# EAGLE schematic swbox_main (EAGLE 6.3)
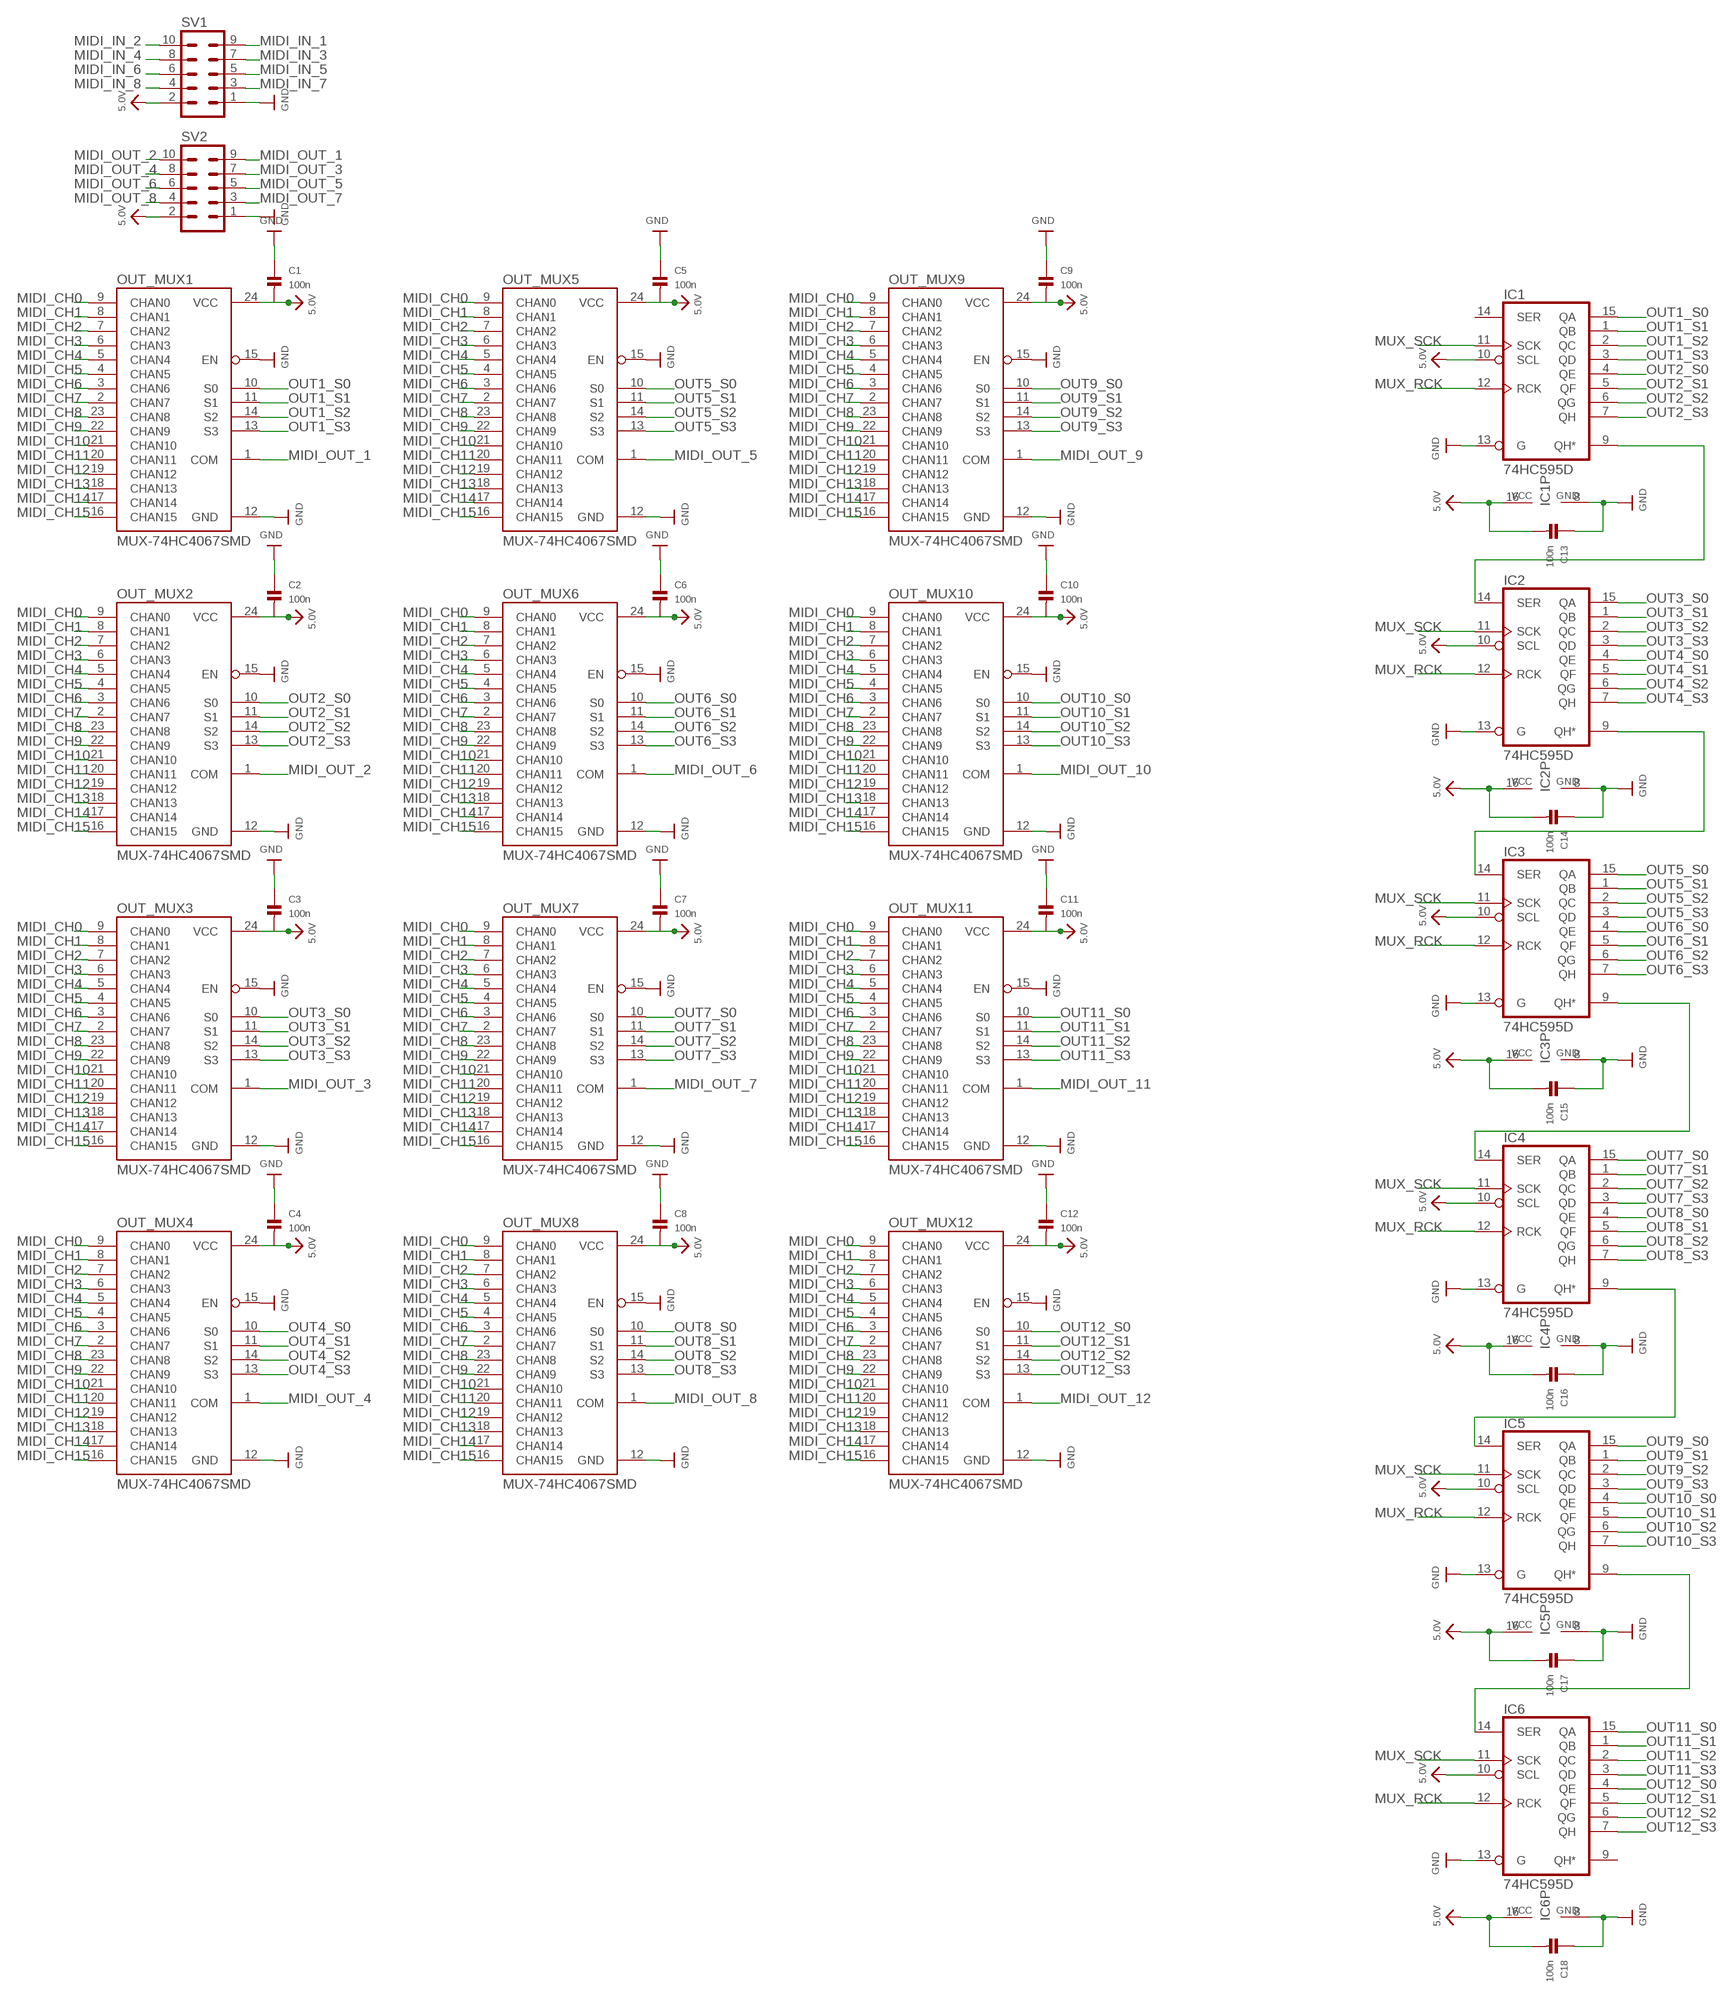
[diagram p0: schematic, sheet 1]

## Parts
C1  100n  CAP_CERAMIC0603  [0603]
C2  100n  CAP_CERAMIC0603  [0603]
C3  100n  CAP_CERAMIC0603  [0603]
C4  100n  CAP_CERAMIC0603  [0603]
C5  100n  CAP_CERAMIC0603  [0603]
C6  100n  CAP_CERAMIC0603  [0603]
C7  100n  CAP_CERAMIC0603  [0603]
C8  100n  CAP_CERAMIC0603  [0603]
C9  100n  CAP_CERAMIC0603  [0603]
C10  100n  CAP_CERAMIC0603  [0603]
C11  100n  CAP_CERAMIC0603  [0603]
C12  100n  CAP_CERAMIC0603  [0603]
C13  100n  CAP_CERAMIC0603  [0603]
C14  100n  CAP_CERAMIC0603  [0603]
C15  100n  CAP_CERAMIC0603  [0603]
C16  100n  CAP_CERAMIC0603  [0603]
C17  100n  CAP_CERAMIC0603  [0603]
C18  100n  CAP_CERAMIC0603  [0603]
IC1  74HC595D  [SO16]
IC2  74HC595D  [SO16]
IC3  74HC595D  [SO16]
IC4  74HC595D  [SO16]
IC5  74HC595D  [SO16]
IC6  74HC595D  [SO16]
OUT_MUX1  MUX-74HC4067SMD  [SSOP24]
OUT_MUX2  MUX-74HC4067SMD  [SSOP24]
OUT_MUX3  MUX-74HC4067SMD  [SSOP24]
OUT_MUX4  MUX-74HC4067SMD  [SSOP24]
OUT_MUX5  MUX-74HC4067SMD  [SSOP24]
OUT_MUX6  MUX-74HC4067SMD  [SSOP24]
OUT_MUX7  MUX-74HC4067SMD  [SSOP24]
OUT_MUX8  MUX-74HC4067SMD  [SSOP24]
OUT_MUX9  MUX-74HC4067SMD  [SSOP24]
OUT_MUX10  MUX-74HC4067SMD  [SSOP24]
OUT_MUX11  MUX-74HC4067SMD  [SSOP24]
OUT_MUX12  MUX-74HC4067SMD  [SSOP24]
SV1  ML10  [ML10]
SV2  ML10  [ML10]

## Nets
5.0V: C1.2 C2.2 C3.2 C4.2 C5.2 C6.2 C7.2 C8.2 C9.2 C10.2 C11.2 C12.2 C13.2 C14.2 C15.2 C16.2 C17.2 C18.2 IC1.10(SCL) IC1.16(VCC) IC2.10(SCL) IC2.16(VCC) IC3.10(SCL) IC3.16(VCC) IC4.10(SCL) IC4.16(VCC) IC5.10(SCL) IC5.16(VCC) IC6.10(SCL) IC6.16(VCC) OUT_MUX1.24(VCC) OUT_MUX2.24(VCC) OUT_MUX3.24(VCC) OUT_MUX4.24(VCC) OUT_MUX5.24(VCC) OUT_MUX6.24(VCC) OUT_MUX7.24(VCC) OUT_MUX8.24(VCC) OUT_MUX9.24(VCC) OUT_MUX10.24(VCC) OUT_MUX11.24(VCC) OUT_MUX12.24(VCC) SV1.2 SV2.2
GND: C1.1 C2.1 C3.1 C4.1 C5.1 C6.1 C7.1 C8.1 C9.1 C10.1 C11.1 C12.1 C13.1 C14.1 C15.1 C16.1 C17.1 C18.1 IC1.8(GND) IC1.13(G) IC2.8(GND) IC2.13(G) IC3.8(GND) IC3.13(G) IC4.8(GND) IC4.13(G) IC5.8(GND) IC5.13(G) IC6.8(GND) IC6.13(G) OUT_MUX1.12(GND) OUT_MUX1.15(EN) OUT_MUX2.12(GND) OUT_MUX2.15(EN) OUT_MUX3.12(GND) OUT_MUX3.15(EN) OUT_MUX4.12(GND) OUT_MUX4.15(EN) OUT_MUX5.12(GND) OUT_MUX5.15(EN) OUT_MUX6.12(GND) OUT_MUX6.15(EN) OUT_MUX7.12(GND) OUT_MUX7.15(EN) OUT_MUX8.12(GND) OUT_MUX8.15(EN) OUT_MUX9.12(GND) OUT_MUX9.15(EN) OUT_MUX10.12(GND) OUT_MUX10.15(EN) OUT_MUX11.12(GND) OUT_MUX11.15(EN) OUT_MUX12.12(GND) OUT_MUX12.15(EN) SV1.1 SV2.1
MIDI_CH0: OUT_MUX1.9(CHAN0) OUT_MUX2.9(CHAN0) OUT_MUX3.9(CHAN0) OUT_MUX4.9(CHAN0) OUT_MUX5.9(CHAN0) OUT_MUX6.9(CHAN0) OUT_MUX7.9(CHAN0) OUT_MUX8.9(CHAN0) OUT_MUX9.9(CHAN0) OUT_MUX10.9(CHAN0) OUT_MUX11.9(CHAN0) OUT_MUX12.9(CHAN0)
MIDI_CH1: OUT_MUX1.8(CHAN1) OUT_MUX2.8(CHAN1) OUT_MUX3.8(CHAN1) OUT_MUX4.8(CHAN1) OUT_MUX5.8(CHAN1) OUT_MUX6.8(CHAN1) OUT_MUX7.8(CHAN1) OUT_MUX8.8(CHAN1) OUT_MUX9.8(CHAN1) OUT_MUX10.8(CHAN1) OUT_MUX11.8(CHAN1) OUT_MUX12.8(CHAN1)
MIDI_CH2: OUT_MUX1.7(CHAN2) OUT_MUX2.7(CHAN2) OUT_MUX3.7(CHAN2) OUT_MUX4.7(CHAN2) OUT_MUX5.7(CHAN2) OUT_MUX6.7(CHAN2) OUT_MUX7.7(CHAN2) OUT_MUX8.7(CHAN2) OUT_MUX9.7(CHAN2) OUT_MUX10.7(CHAN2) OUT_MUX11.7(CHAN2) OUT_MUX12.7(CHAN2)
MIDI_CH3: OUT_MUX1.6(CHAN3) OUT_MUX2.6(CHAN3) OUT_MUX3.6(CHAN3) OUT_MUX4.6(CHAN3) OUT_MUX5.6(CHAN3) OUT_MUX6.6(CHAN3) OUT_MUX7.6(CHAN3) OUT_MUX8.6(CHAN3) OUT_MUX9.6(CHAN3) OUT_MUX10.6(CHAN3) OUT_MUX11.6(CHAN3) OUT_MUX12.6(CHAN3)
MIDI_CH4: OUT_MUX1.5(CHAN4) OUT_MUX2.5(CHAN4) OUT_MUX3.5(CHAN4) OUT_MUX4.5(CHAN4) OUT_MUX5.5(CHAN4) OUT_MUX6.5(CHAN4) OUT_MUX7.5(CHAN4) OUT_MUX8.5(CHAN4) OUT_MUX9.5(CHAN4) OUT_MUX10.5(CHAN4) OUT_MUX11.5(CHAN4) OUT_MUX12.5(CHAN4)
MIDI_CH5: OUT_MUX1.4(CHAN5) OUT_MUX2.4(CHAN5) OUT_MUX3.4(CHAN5) OUT_MUX4.4(CHAN5) OUT_MUX5.4(CHAN5) OUT_MUX6.4(CHAN5) OUT_MUX7.4(CHAN5) OUT_MUX8.4(CHAN5) OUT_MUX9.4(CHAN5) OUT_MUX10.4(CHAN5) OUT_MUX11.4(CHAN5) OUT_MUX12.4(CHAN5)
MIDI_CH6: OUT_MUX1.3(CHAN6) OUT_MUX2.3(CHAN6) OUT_MUX3.3(CHAN6) OUT_MUX4.3(CHAN6) OUT_MUX5.3(CHAN6) OUT_MUX6.3(CHAN6) OUT_MUX7.3(CHAN6) OUT_MUX8.3(CHAN6) OUT_MUX9.3(CHAN6) OUT_MUX10.3(CHAN6) OUT_MUX11.3(CHAN6) OUT_MUX12.3(CHAN6)
MIDI_CH7: OUT_MUX1.2(CHAN7) OUT_MUX2.2(CHAN7) OUT_MUX3.2(CHAN7) OUT_MUX4.2(CHAN7) OUT_MUX5.2(CHAN7) OUT_MUX6.2(CHAN7) OUT_MUX7.2(CHAN7) OUT_MUX8.2(CHAN7) OUT_MUX9.2(CHAN7) OUT_MUX10.2(CHAN7) OUT_MUX11.2(CHAN7) OUT_MUX12.2(CHAN7)
MIDI_CH8: OUT_MUX1.23(CHAN8) OUT_MUX2.23(CHAN8) OUT_MUX3.23(CHAN8) OUT_MUX4.23(CHAN8) OUT_MUX5.23(CHAN8) OUT_MUX6.23(CHAN8) OUT_MUX7.23(CHAN8) OUT_MUX8.23(CHAN8) OUT_MUX9.23(CHAN8) OUT_MUX10.23(CHAN8) OUT_MUX11.23(CHAN8) OUT_MUX12.23(CHAN8)
MIDI_CH9: OUT_MUX1.22(CHAN9) OUT_MUX2.22(CHAN9) OUT_MUX3.22(CHAN9) OUT_MUX4.22(CHAN9) OUT_MUX5.22(CHAN9) OUT_MUX6.22(CHAN9) OUT_MUX7.22(CHAN9) OUT_MUX8.22(CHAN9) OUT_MUX9.22(CHAN9) OUT_MUX10.22(CHAN9) OUT_MUX11.22(CHAN9) OUT_MUX12.22(CHAN9)
MIDI_CH10: OUT_MUX1.21(CHAN10) OUT_MUX2.21(CHAN10) OUT_MUX3.21(CHAN10) OUT_MUX4.21(CHAN10) OUT_MUX5.21(CHAN10) OUT_MUX6.21(CHAN10) OUT_MUX7.21(CHAN10) OUT_MUX8.21(CHAN10) OUT_MUX9.21(CHAN10) OUT_MUX10.21(CHAN10) OUT_MUX11.21(CHAN10) OUT_MUX12.21(CHAN10)
MIDI_CH11: OUT_MUX1.20(CHAN11) OUT_MUX2.20(CHAN11) OUT_MUX3.20(CHAN11) OUT_MUX4.20(CHAN11) OUT_MUX5.20(CHAN11) OUT_MUX6.20(CHAN11) OUT_MUX7.20(CHAN11) OUT_MUX8.20(CHAN11) OUT_MUX9.20(CHAN11) OUT_MUX10.20(CHAN11) OUT_MUX11.20(CHAN11) OUT_MUX12.20(CHAN11)
MIDI_CH12: OUT_MUX1.19(CHAN12) OUT_MUX2.19(CHAN12) OUT_MUX3.19(CHAN12) OUT_MUX4.19(CHAN12) OUT_MUX5.19(CHAN12) OUT_MUX6.19(CHAN12) OUT_MUX7.19(CHAN12) OUT_MUX8.19(CHAN12) OUT_MUX9.19(CHAN12) OUT_MUX10.19(CHAN12) OUT_MUX11.19(CHAN12) OUT_MUX12.19(CHAN12)
MIDI_CH13: OUT_MUX1.18(CHAN13) OUT_MUX2.18(CHAN13) OUT_MUX3.18(CHAN13) OUT_MUX4.18(CHAN13) OUT_MUX5.18(CHAN13) OUT_MUX6.18(CHAN13) OUT_MUX7.18(CHAN13) OUT_MUX8.18(CHAN13) OUT_MUX9.18(CHAN13) OUT_MUX10.18(CHAN13) OUT_MUX11.18(CHAN13) OUT_MUX12.18(CHAN13)
MIDI_CH14: OUT_MUX1.17(CHAN14) OUT_MUX2.17(CHAN14) OUT_MUX3.17(CHAN14) OUT_MUX4.17(CHAN14) OUT_MUX5.17(CHAN14) OUT_MUX6.17(CHAN14) OUT_MUX7.17(CHAN14) OUT_MUX8.17(CHAN14) OUT_MUX9.17(CHAN14) OUT_MUX10.17(CHAN14) OUT_MUX11.17(CHAN14) OUT_MUX12.17(CHAN14)
MIDI_CH15: OUT_MUX1.16(CHAN15) OUT_MUX2.16(CHAN15) OUT_MUX3.16(CHAN15) OUT_MUX4.16(CHAN15) OUT_MUX5.16(CHAN15) OUT_MUX6.16(CHAN15) OUT_MUX7.16(CHAN15) OUT_MUX8.16(CHAN15) OUT_MUX9.16(CHAN15) OUT_MUX10.16(CHAN15) OUT_MUX11.16(CHAN15) OUT_MUX12.16(CHAN15)
MIDI_IN_1: SV1.9
MIDI_IN_2: SV1.10
MIDI_IN_3: SV1.7
MIDI_IN_4: SV1.8
MIDI_IN_5: SV1.5
MIDI_IN_6: SV1.6
MIDI_IN_7: SV1.3
MIDI_IN_8: SV1.4
MIDI_OUT_1: OUT_MUX1.1(COM) SV2.9
MIDI_OUT_2: OUT_MUX2.1(COM) SV2.10
MIDI_OUT_3: OUT_MUX3.1(COM) SV2.7
MIDI_OUT_4: OUT_MUX4.1(COM) SV2.8
MIDI_OUT_5: OUT_MUX5.1(COM) SV2.5
MIDI_OUT_6: OUT_MUX6.1(COM) SV2.6
MIDI_OUT_7: OUT_MUX7.1(COM) SV2.3
MIDI_OUT_8: OUT_MUX8.1(COM) SV2.4
MIDI_OUT_9: OUT_MUX9.1(COM)
MIDI_OUT_10: OUT_MUX10.1(COM)
MIDI_OUT_11: OUT_MUX11.1(COM)
MIDI_OUT_12: OUT_MUX12.1(COM)
MUX_RCK: IC1.12(RCK) IC2.12(RCK) IC3.12(RCK) IC4.12(RCK) IC5.12(RCK) IC6.12(RCK)
MUX_SCK: IC1.11(SCK) IC2.11(SCK) IC3.11(SCK) IC4.11(SCK) IC5.11(SCK) IC6.11(SCK)
N$1: IC1.9(QH*) IC2.14(SER)
N$2: IC2.9(QH*) IC3.14(SER)
N$3: IC3.9(QH*) IC4.14(SER)
N$4: IC4.9(QH*) IC5.14(SER)
N$5: IC5.9(QH*) IC6.14(SER)
OUT1_S0: IC1.15(QA) OUT_MUX1.10(S0)
OUT1_S1: IC1.1(QB) OUT_MUX1.11(S1)
OUT1_S2: IC1.2(QC) OUT_MUX1.14(S2)
OUT1_S3: IC1.3(QD) OUT_MUX1.13(S3)
OUT2_S0: IC1.4(QE) OUT_MUX2.10(S0)
OUT2_S1: IC1.5(QF) OUT_MUX2.11(S1)
OUT2_S2: IC1.6(QG) OUT_MUX2.14(S2)
OUT2_S3: IC1.7(QH) OUT_MUX2.13(S3)
OUT3_S0: IC2.15(QA) OUT_MUX3.10(S0)
OUT3_S1: IC2.1(QB) OUT_MUX3.11(S1)
OUT3_S2: IC2.2(QC) OUT_MUX3.14(S2)
OUT3_S3: IC2.3(QD) OUT_MUX3.13(S3)
OUT4_S0: IC2.4(QE) OUT_MUX4.10(S0)
OUT4_S1: IC2.5(QF) OUT_MUX4.11(S1)
OUT4_S2: IC2.6(QG) OUT_MUX4.14(S2)
OUT4_S3: IC2.7(QH) OUT_MUX4.13(S3)
OUT5_S0: IC3.15(QA) OUT_MUX5.10(S0)
OUT5_S1: IC3.1(QB) OUT_MUX5.11(S1)
OUT5_S2: IC3.2(QC) OUT_MUX5.14(S2)
OUT5_S3: IC3.3(QD) OUT_MUX5.13(S3)
OUT6_S0: IC3.4(QE) OUT_MUX6.10(S0)
OUT6_S1: IC3.5(QF) OUT_MUX6.11(S1)
OUT6_S2: IC3.6(QG) OUT_MUX6.14(S2)
OUT6_S3: IC3.7(QH) OUT_MUX6.13(S3)
OUT7_S0: IC4.15(QA) OUT_MUX7.10(S0)
OUT7_S1: IC4.1(QB) OUT_MUX7.11(S1)
OUT7_S2: IC4.2(QC) OUT_MUX7.14(S2)
OUT7_S3: IC4.3(QD) OUT_MUX7.13(S3)
OUT8_S0: IC4.4(QE) OUT_MUX8.10(S0)
OUT8_S1: IC4.5(QF) OUT_MUX8.11(S1)
OUT8_S2: IC4.6(QG) OUT_MUX8.14(S2)
OUT8_S3: IC4.7(QH) OUT_MUX8.13(S3)
OUT9_S0: IC5.15(QA) OUT_MUX9.10(S0)
OUT9_S1: IC5.1(QB) OUT_MUX9.11(S1)
OUT9_S2: IC5.2(QC) OUT_MUX9.14(S2)
OUT9_S3: IC5.3(QD) OUT_MUX9.13(S3)
OUT10_S0: IC5.4(QE) OUT_MUX10.10(S0)
OUT10_S1: IC5.5(QF) OUT_MUX10.11(S1)
OUT10_S2: IC5.6(QG) OUT_MUX10.14(S2)
OUT10_S3: IC5.7(QH) OUT_MUX10.13(S3)
OUT11_S0: IC6.15(QA) OUT_MUX11.10(S0)
OUT11_S1: IC6.1(QB) OUT_MUX11.11(S1)
OUT11_S2: IC6.2(QC) OUT_MUX11.14(S2)
OUT11_S3: IC6.3(QD) OUT_MUX11.13(S3)
OUT12_S0: IC6.4(QE) OUT_MUX12.10(S0)
OUT12_S1: IC6.5(QF) OUT_MUX12.11(S1)
OUT12_S2: IC6.6(QG) OUT_MUX12.14(S2)
OUT12_S3: IC6.7(QH) OUT_MUX12.13(S3)
Unconnected: IC1.14(SER) IC6.9(QH*)

## Library data of the parts
C1-C18 = microbuilder:CAP_CERAMIC: Ceramic Capacitors 0402 - 0402 Surface Mount Capacitors 16pF 50V 5% [Digikey: 445-4899-2-ND] 18pF 50V 5% [Digikey: 490-1281-2-ND] 22pF 50V 5% [Digikey: 490-1283-2-ND] 68pF 50V 5% [Digikey: 490-1289-2-ND] 0.1uF 10V 10% [Digikey: 490-1318-2-ND] 1.0uF 6.3V 10% [Digikey: 490-1320-2-ND] 0603 - 0603 Surface Mount Capacitors 16 pF 50V 5% [Digikey: 445-5051-2-ND] 22 pF 50V [Digikey: PCC220ACVTR-ND] 33 pF 50V 5% [Digikey: 490-1415-1-ND] 56pF 50V 5% [Digikey: 490-1421-1-ND] 220pF 50V 5% [Digikey: 445-1285-1-ND] 680 pF 50V 2200 pF 50V 5% C0G [Digikey: 445-1297-1-ND] 5600 pF 100V 5% X7R [Digikey: 478-3711-1-ND] 0.1 µF 25V 10% [Digikey: PCC2277TR-ND] 0.22 µF 16V 10% X7R [Digikey: 445-1318-1-ND] 1.0 µF 25V 10% [Digikey: 445-5146-2-ND] 0603 - RF Specific 3pF 250V +/-0.1pF RF [Digikey: 712-1347-1-ND] 18 pF 250V 5% [Digikey: 478-3505-1-ND or 712-1322-1-ND] 56 pF 250V 5% C0G RF [Digikey: 490-4867-1-ND] 68 pF 250V RF [Digikey: 490-4868-1-ND] 0805 - 0805 Surface Mount Capacitors 220 pF 250V 2% RF Ceramic Capacitor [Digikey: 712-1398-1-ND] 1000 pF 50V 2% NP0 Ceramic Capacitor [Digikey: 478-3760-1-ND] 0.1 µF 25V 10% Ceramic Capacitor [Digikey: PCC1828TR-ND] 1.0 µF 16V 10% Ceramic Capacitor[Digikey: 490-1691-2-ND] 10.0 µF 10V 10% Ceramic Capacitor[Digikey: 709-1228-1-ND] 10.0 uF 16V 10% Ceramic Capacitor [Digikey: 478-5165-2-ND] 47 uF 6.3V 20% Ceramic Capacitor [Digikey: 587-1779-1-ND or 399-5506-1-ND] 1206 - 1206 Surface Mount Capacitors 47uF 10V 20% Ceramic Capacitor [Digikey: 490-5528-1-ND or 399-5508-1-ND or 445-6010-1-ND] 100uF 6.3V -20%, +80% Y5V Ceramic Capacitor (Digikey: 490-4512-1-ND, Mouser: 81-GRM31CF50J107ZE1L)
IC1-IC6 = 74xx-eu:74*595: 8-bit SHIFT REGISTER, output latch
OUT_MUX1-OUT_MUX12 = SparkFun-AnalogIC:MUX-74HC4067: 16-channel analog MUX
SV1 SV2 = con-harting-ml:ML10: HARTING; OC_FARNELL: unknown; OC_NEWARK: unknown